# EAGLE schematic Lab9 (EAGLE 8.7.1)
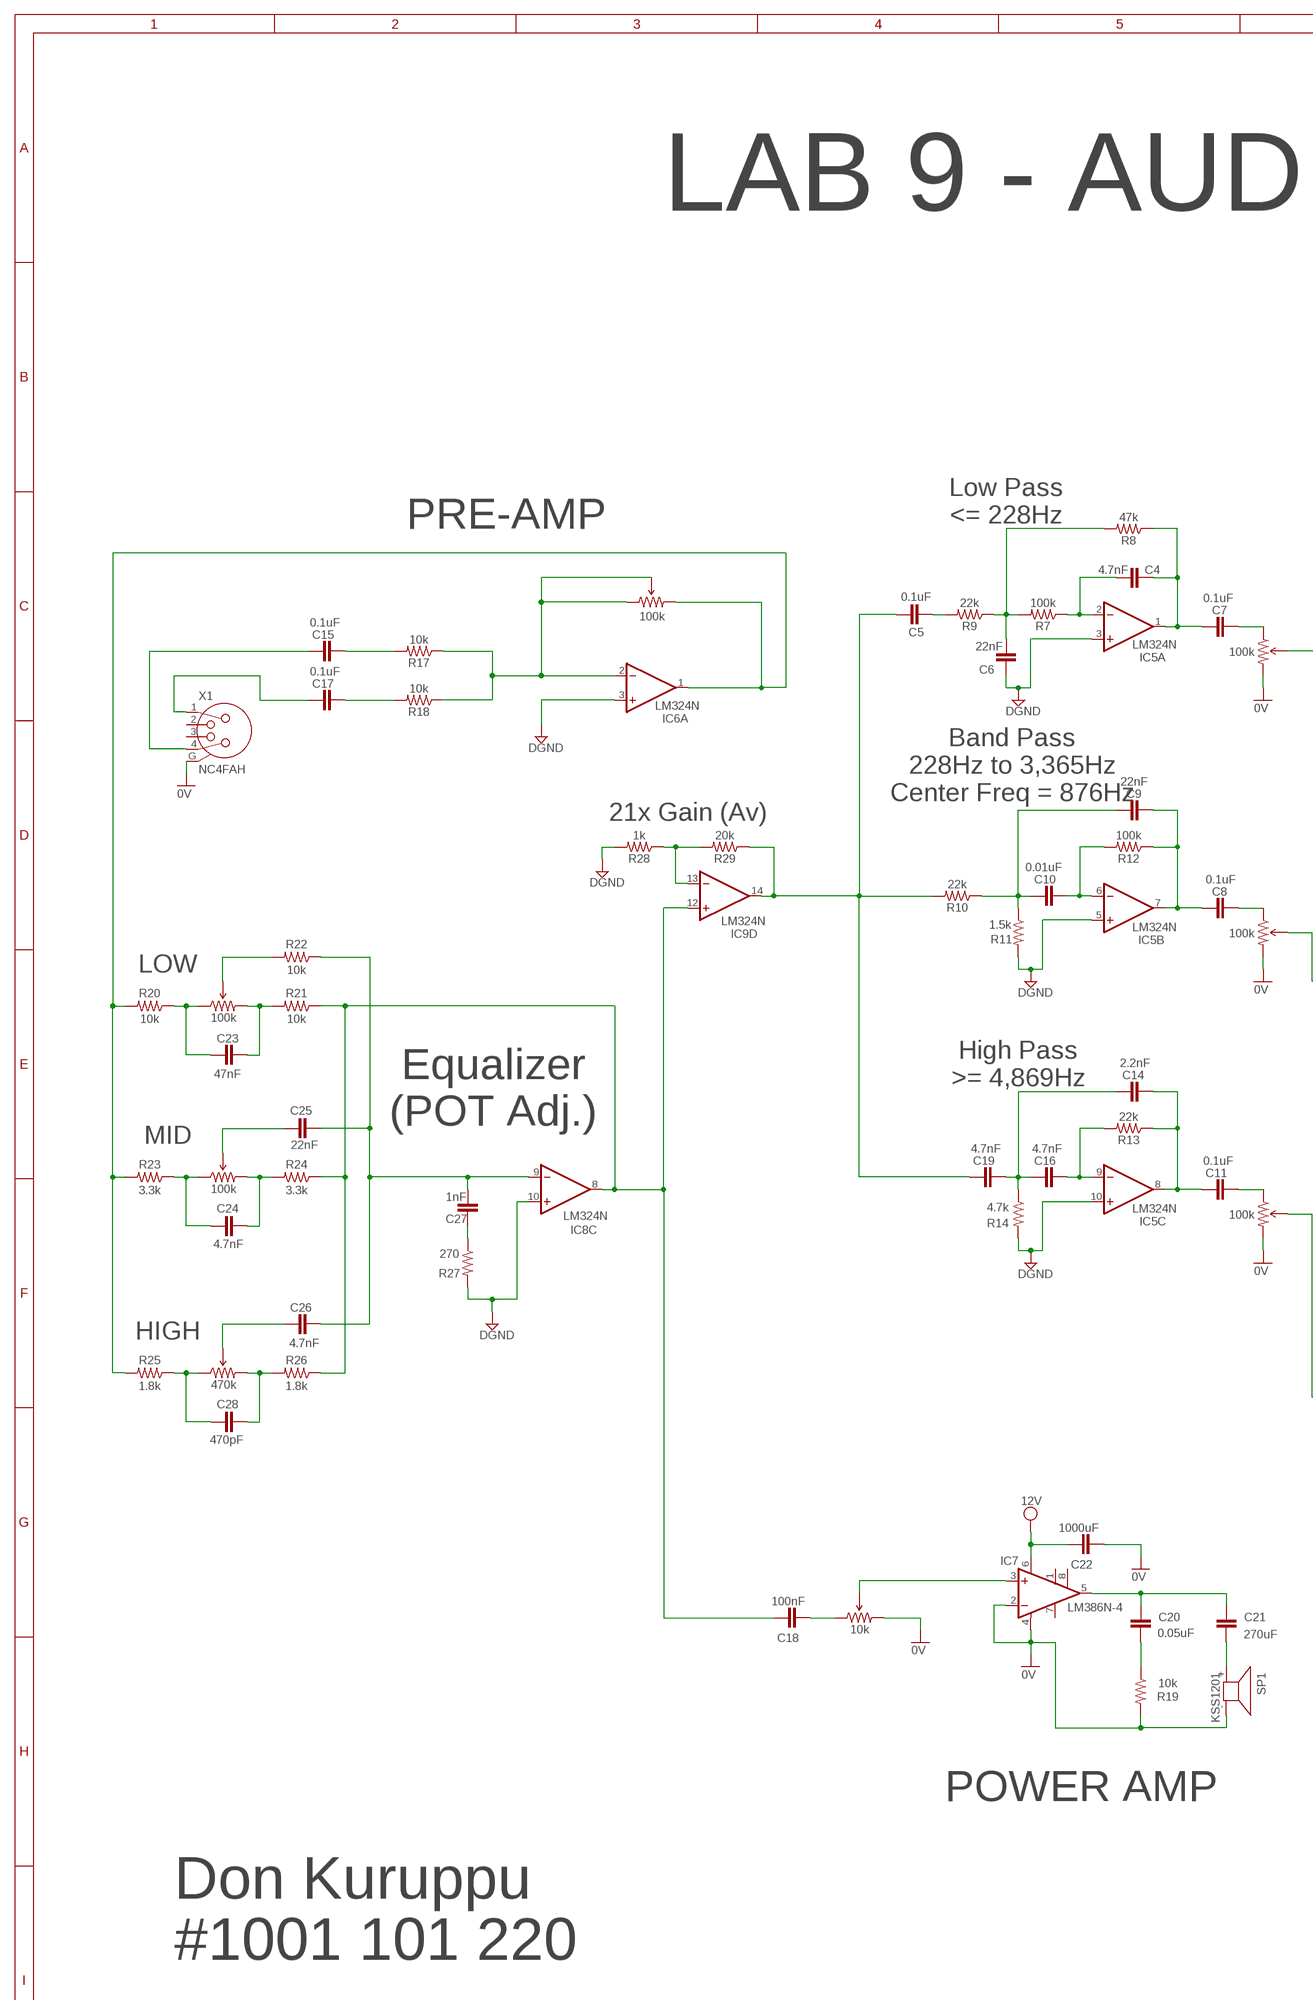
[diagram p0: schematic, sheet 1, part 1 of 2]
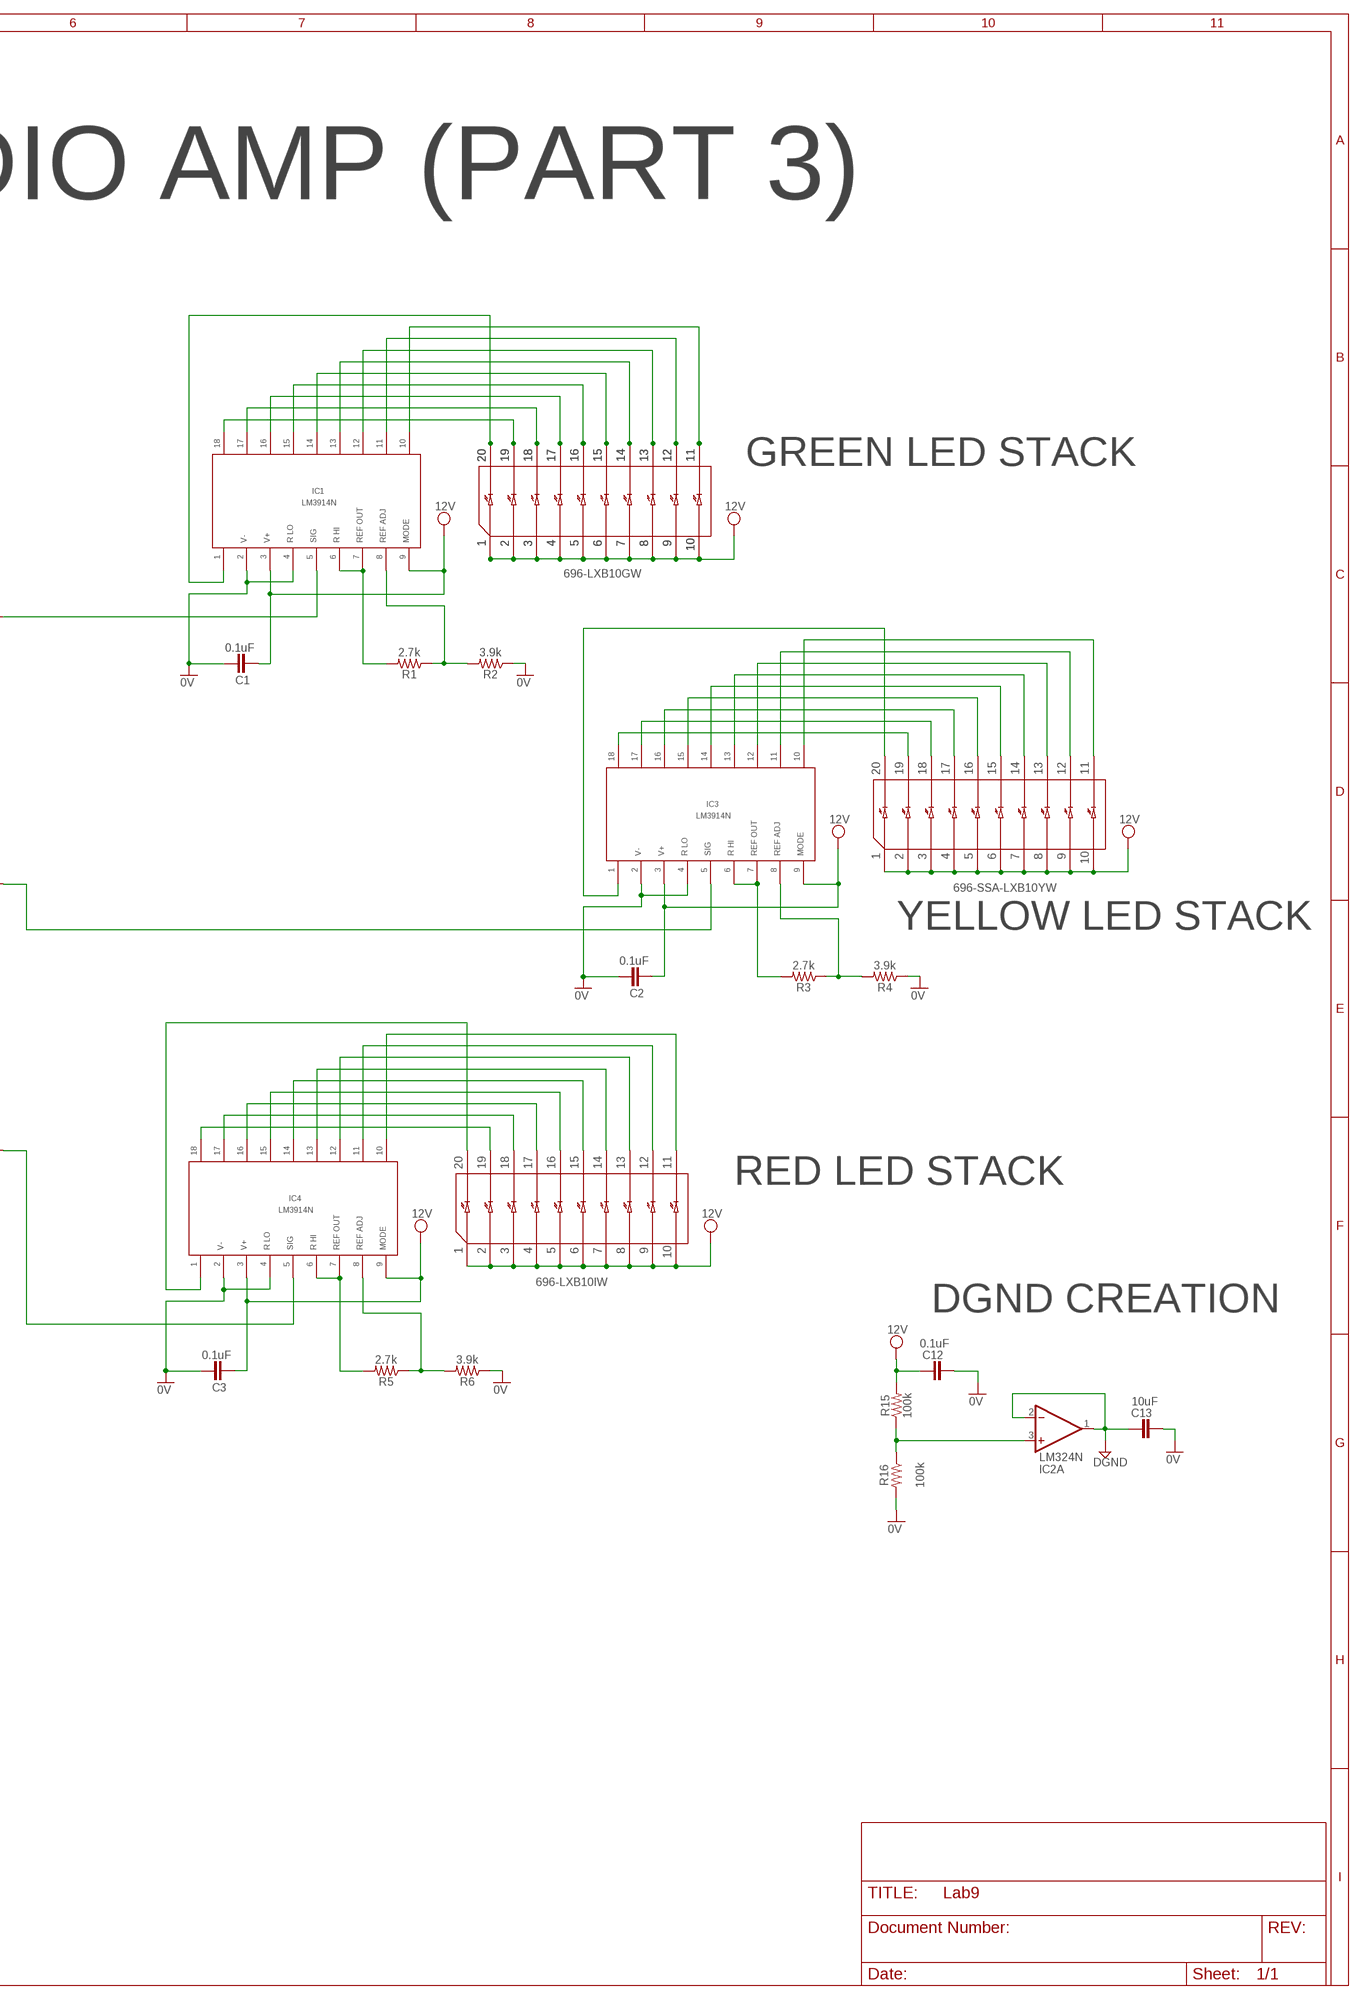
[diagram p1: schematic, sheet 1, part 2 of 2]

## Parts
C1  0.1uF  0.1UF-KIT-EZ-50V-20%  [CAP-PTH-SMALL-KIT]
C2  0.1uF  0.1UF-KIT-EZ-50V-20%  [CAP-PTH-SMALL-KIT]
C3  0.1uF  0.1UF-KIT-EZ-50V-20%  [CAP-PTH-SMALL-KIT]
C4  4.7nF  0.1UF-KIT-EZ-50V-20%  [CAP-PTH-SMALL-KIT]
C5  0.1uF  0.1UF-KIT-EZ-50V-20%  [CAP-PTH-SMALL-KIT]
C6  22nF  0.1UF-KIT-EZ-50V-20%  [CAP-PTH-SMALL-KIT]
C7  0.1uF  0.1UF-KIT-EZ-50V-20%  [CAP-PTH-SMALL-KIT]
C8  0.1uF  0.1UF-KIT-EZ-50V-20%  [CAP-PTH-SMALL-KIT]
C9  22nF  0.1UF-KIT-EZ-50V-20%  [CAP-PTH-SMALL-KIT]
C10  0.01uF  0.1UF-KIT-EZ-50V-20%  [CAP-PTH-SMALL-KIT]
C11  0.1uF  0.1UF-KIT-EZ-50V-20%  [CAP-PTH-SMALL-KIT]
C12  0.1uF  0.1UF-KIT-EZ-50V-20%  [CAP-PTH-SMALL-KIT]
C13  10uF  0.1UF-KIT-EZ-50V-20%  [CAP-PTH-SMALL-KIT]
C14  2.2nF  0.1UF-KIT-EZ-50V-20%  [CAP-PTH-SMALL-KIT]
C15  0.1uF  0.1UF-KIT-EZ-50V-20%  [CAP-PTH-SMALL-KIT]
C16  4.7nF  0.1UF-KIT-EZ-50V-20%  [CAP-PTH-SMALL-KIT]
C17  0.1uF  0.1UF-KIT-EZ-50V-20%  [CAP-PTH-SMALL-KIT]
C18  100nF  0.1UF-KIT-EZ-50V-20%  [CAP-PTH-SMALL-KIT]
C19  4.7nF  0.1UF-KIT-EZ-50V-20%  [CAP-PTH-SMALL-KIT]
C20  0.05uF  0.1UF-KIT-EZ-50V-20%  [CAP-PTH-SMALL-KIT]
C21  270uF  0.1UF-KIT-EZ-50V-20%  [CAP-PTH-SMALL-KIT]
C22  1000uF  0.1UF-KIT-EZ-50V-20%  [CAP-PTH-SMALL-KIT]
C23  47nF  0.1UF-KIT-EZ-50V-20%  [CAP-PTH-SMALL-KIT]
C24  4.7nF  0.1UF-KIT-EZ-50V-20%  [CAP-PTH-SMALL-KIT]
C25  22nF  0.1UF-KIT-EZ-50V-20%  [CAP-PTH-SMALL-KIT]
C26  4.7nF  0.1UF-KIT-EZ-50V-20%  [CAP-PTH-SMALL-KIT]
C27  1nF  0.1UF-KIT-EZ-50V-20%  [CAP-PTH-SMALL-KIT]
C28  470pF  0.1UF-KIT-EZ-50V-20%  [CAP-PTH-SMALL-KIT]
IC1  LM3914N  [DIL18]
IC2  LM324N  [DIL14]
IC3  LM3914N  [DIL18]
IC4  LM3914N  [DIL18]
IC5  LM324N  [DIL14]
IC6  LM324N  [DIL14]
IC7  LM386N-4  [DIL08]
IC8  LM324N  [DIL14]
IC9  LM324N  [DIL14]
POT1  100k  TRIMPOT  [TRIM_POT_PTH]
POT2  100k  TRIMPOT  [TRIM_POT_PTH]
POT3  100k  TRIMPOT  [TRIM_POT_PTH]
POT4  100k  TRIMPOT  [TRIM_POT_PTH]
POT5  10k  TRIMPOT  [TRIM_POT_PTH]
POT6  100k  TRIMPOT  [TRIM_POT_PTH]
POT7  100k  TRIMPOT  [TRIM_POT_PTH]
POT8  470k  TRIMPOT  [TRIM_POT_PTH]
R1  2.7k  100KOHM-HORIZ-1/4W-1%  [AXIAL-0.3]
R2  3.9k  100KOHM-HORIZ-1/4W-1%  [AXIAL-0.3]
R3  2.7k  100KOHM-HORIZ-1/4W-1%  [AXIAL-0.3]
R4  3.9k  100KOHM-HORIZ-1/4W-1%  [AXIAL-0.3]
R5  2.7k  100KOHM-HORIZ-1/4W-1%  [AXIAL-0.3]
R6  3.9k  100KOHM-HORIZ-1/4W-1%  [AXIAL-0.3]
R7  100k  100KOHM-HORIZ-1/4W-1%  [AXIAL-0.3]
R8  47k  100KOHM-HORIZ-1/4W-1%  [AXIAL-0.3]
R9  22k  100KOHM-HORIZ-1/4W-1%  [AXIAL-0.3]
R10  22k  100KOHM-HORIZ-1/4W-1%  [AXIAL-0.3]
R11  1.5k  100KOHM-HORIZ-1/4W-1%  [AXIAL-0.3]
R12  100k  100KOHM-HORIZ-1/4W-1%  [AXIAL-0.3]
R13  22k  100KOHM-HORIZ-1/4W-1%  [AXIAL-0.3]
R14  4.7k  100KOHM-HORIZ-1/4W-1%  [AXIAL-0.3]
R15  100k  100KOHM-HORIZ-1/4W-1%  [AXIAL-0.3]
R16  100k  100KOHM-HORIZ-1/4W-1%  [AXIAL-0.3]
R17  10k  100KOHM-HORIZ-1/4W-1%  [AXIAL-0.3]
R18  10k  100KOHM-HORIZ-1/4W-1%  [AXIAL-0.3]
R19  10k  100KOHM-HORIZ-1/4W-1%  [AXIAL-0.3]
R20  10k  100KOHM-HORIZ-1/4W-1%  [AXIAL-0.3]
R21  10k  100KOHM-HORIZ-1/4W-1%  [AXIAL-0.3]
R22  10k  100KOHM-HORIZ-1/4W-1%  [AXIAL-0.3]
R23  3.3k  100KOHM-HORIZ-1/4W-1%  [AXIAL-0.3]
R24  3.3k  100KOHM-HORIZ-1/4W-1%  [AXIAL-0.3]
R25  1.8k  100KOHM-HORIZ-1/4W-1%  [AXIAL-0.3]
R26  1.8k  100KOHM-HORIZ-1/4W-1%  [AXIAL-0.3]
R27  270  100KOHM-HORIZ-1/4W-1%  [AXIAL-0.3]
R28  1k  100KOHM-HORIZ-1/4W-1%  [AXIAL-0.3]
R29  20k  100KOHM-HORIZ-1/4W-1%  [AXIAL-0.3]
SP1  KSS1201  [KSS1201]
STACK1  696-LXB10GW  [LED_STACK_PROTO]
STACK2  696-LXB10GW  [LED_STACK_PROTO]
STACK3  696-SSA-LXB10YW  [LED_STACK_PROTO]
STACK4  696-LXB10IW  [LED_STACK_PROTO]
X1  NC4FAH  [NC4FAH]

## Nets
0V: C1.1 C2.1 C3.1 C12.2 C13.2 C22.2 IC1.2 IC1.4 IC3.2 IC3.4 IC4.2 IC4.4 IC7.2(-IN) IC7.4(GND) POT1.3(CW) POT2.3(CW) POT3.3(CW) POT5.3(CW) R2.P$1 R4.P$1 R6.P$1 R16.P$2 R19.P$2 SP1.- X1.G
DGND: C6.1 C13.1 IC2.1(A:OUT) IC2.2(A:-IN) IC5.3(A:+IN) IC5.5(B:+IN) IC5.10(C:+IN) IC6.3(A:+IN) IC8.10(C:+IN) R11.P$2 R14.P$2 R27.P$2 R28.P$2
N$1: IC1.6 IC1.7 R1.P$2
N$2: IC2.3(A:+IN) R15.P$1 R16.P$1
N$3: IC1.1 STACK1.P$11 STACK2.P$11
N$4: IC1.18 STACK1.P$12 STACK2.P$12
N$5: IC1.17 STACK1.P$13 STACK2.P$13
N$6: IC1.16 STACK1.P$14 STACK2.P$14
N$7: IC1.15 STACK1.P$15 STACK2.P$15
N$8: C17.1 X1.1
N$9: C15.1 X1.4
N$10: IC1.14 STACK1.P$16 STACK2.P$16
N$11: C15.2 R17.P$2
N$12: IC1.13 STACK1.P$17 STACK2.P$17
N$13: IC1.12 STACK1.P$18 STACK2.P$18
N$14: IC1.11 STACK1.P$19 STACK2.P$19
N$15: C5.2 R9.P$2
N$16: IC1.5 POT1.2(WIPER)
N$17: C17.2 R18.P$2
N$18: IC1.10 STACK1.P$20 STACK2.P$20
N$19: IC1.8 R1.P$1 R2.P$2
N$20: IC4.1 STACK4.P$11
N$21: IC3.1 STACK3.P$11
N$22: IC3.18 STACK3.P$12
N$23: IC3.17 STACK3.P$13
N$24: IC3.16 STACK3.P$14
N$25: IC3.15 STACK3.P$15
N$26: IC3.14 STACK3.P$16
N$27: IC3.13 STACK3.P$17
N$28: IC3.12 STACK3.P$18
N$29: IC3.11 STACK3.P$19
N$30: IC3.10 STACK3.P$20
N$31: IC3.6 IC3.7 R3.P$2
N$32: IC3.8 R3.P$1 R4.P$2
N$33: IC3.5 POT2.2(WIPER)
N$34: IC4.18 STACK4.P$12
N$35: IC4.17 STACK4.P$13
N$36: IC4.16 STACK4.P$14
N$37: IC4.15 STACK4.P$15
N$38: IC4.14 STACK4.P$16
N$39: IC4.13 STACK4.P$17
N$40: IC4.12 STACK4.P$18
N$41: IC4.11 STACK4.P$19
N$42: IC4.10 STACK4.P$20
N$43: IC4.6 IC4.7 R5.P$2
N$44: IC4.8 R5.P$1 R6.P$2
N$45: IC4.5 POT3.2(WIPER)
N$46: C4.1 IC5.2(A:-IN) R7.P$1
N$47: C4.2 C7.1 IC5.1(A:OUT) R8.P$1
N$48: C7.2 POT1.1(CCW)
N$49: C9.1 C10.1 R10.P$1 R11.P$1
N$50: C10.2 IC5.6(B:-IN) R12.P$2
N$51: C8.1 C9.2 IC5.7(B:OUT) R12.P$1
N$52: C5.1 C19.1 IC9.14(D:OUT) R10.P$2 R29.P$1
N$53: C8.2 POT2.1(CCW)
N$54: C11.2 POT3.1(CCW)
N$55: C14.1 C16.1 C19.2 R14.P$1
N$56: C16.2 IC5.9(C:-IN) R13.P$2
N$57: C18.2 POT5.1(CCW)
N$58: C11.1 C14.2 IC5.8(C:OUT) R13.P$1
N$59: C6.2 R7.P$2 R8.P$2 R9.P$1
N$60: C20.1 C21.1 IC7.5(OUT)
N$61: IC6.2(A:-IN) POT4.1(CCW) POT4.2(WIPER) R17.P$1 R18.P$1
N$62: IC7.3(+IN) POT5.2(WIPER)
N$63: C20.2 R19.P$1
N$64: C21.2 SP1.+
N$65: C27.1 R27.P$1
N$68: C23.1 POT6.1(CCW) R20.P$1
N$69: C23.2 POT6.3(CW) R21.P$2
N$70: IC6.1(A:OUT) POT4.3(CW) R20.P$2 R23.P$2 R25.P$2
N$71: IC9.13(D:-IN) R28.P$1 R29.P$2
N$72: POT6.2(WIPER) R22.P$2
N$73: C24.1 POT7.1(CCW) R23.P$1
N$74: C24.2 POT7.3(CW) R24.P$2
N$75: C18.1 IC8.8(C:OUT) IC9.12(D:+IN) R21.P$1 R24.P$1 R26.P$1
N$77: C25.1 POT7.2(WIPER)
N$78: C28.1 POT8.1(CCW) R25.P$1
N$79: C28.2 POT8.3(CW) R26.P$2
N$80: C26.1 POT8.2(WIPER)
N$82: C25.2 C26.2 C27.2 IC8.9(C:-IN) R22.P$1
VCC: C1.2 C2.2 C3.2 C12.1 C22.1 IC1.3 IC1.9 IC3.3 IC3.9 IC4.3 IC4.9 IC7.6(VS) R15.P$2 STACK1.P$1 STACK1.P$2 STACK1.P$3 STACK1.P$4 STACK1.P$5 STACK1.P$6 STACK1.P$7 STACK1.P$8 STACK1.P$9 STACK1.P$10 STACK2.P$1 STACK2.P$2 STACK2.P$3 STACK2.P$4 STACK2.P$5 STACK2.P$6 STACK2.P$7 STACK2.P$8 STACK2.P$9 STACK2.P$10 STACK3.P$1 STACK3.P$2 STACK3.P$3 STACK3.P$4 STACK3.P$5 STACK3.P$6 STACK3.P$7 STACK3.P$8 STACK3.P$9 STACK3.P$10 STACK4.P$1 STACK4.P$2 STACK4.P$3 STACK4.P$4 STACK4.P$5 STACK4.P$6 STACK4.P$7 STACK4.P$8 STACK4.P$9 STACK4.P$10
Unconnected: IC2.5(B:+IN) IC2.6(B:-IN) IC2.7(B:OUT) IC2.8(C:OUT) IC2.9(C:-IN) IC2.10(C:+IN) IC2.12(D:+IN) IC2.13(D:-IN) IC2.14(D:OUT) IC5.12(D:+IN) IC5.13(D:-IN) IC5.14(D:OUT) IC6.5(B:+IN) IC6.6(B:-IN) IC6.7(B:OUT) IC6.8(C:OUT) IC6.9(C:-IN) IC6.10(C:+IN) IC6.12(D:+IN) IC6.13(D:-IN) IC6.14(D:OUT) IC7.1(GAIN) IC7.7(BYPASS) IC7.8(GAIN) IC8.1(A:OUT) IC8.2(A:-IN) IC8.3(A:+IN) IC8.5(B:+IN) IC8.6(B:-IN) IC8.7(B:OUT) IC8.12(D:+IN) IC8.13(D:-IN) IC8.14(D:OUT) IC9.1(A:OUT) IC9.2(A:-IN) IC9.3(A:+IN) IC9.5(B:+IN) IC9.6(B:-IN) IC9.7(B:OUT) IC9.8(C:OUT) IC9.9(C:-IN) IC9.10(C:+IN) X1.2 X1.3

## Notes on the sheet
- LAB 9 - AUDIO AMP (PART 3)
- GREEN LED STACK
- Low Pass
  <= 228Hz
- PRE-AMP
- Band Pass
  228Hz to 3,365Hz
  Center Freq = 876Hz
- 21x Gain (Av)
- LOW
- YELLOW LED STACK
- High Pass
  >= 4,869Hz
- Equalizer
  (POT Adj.)
- MID
- RED LED STACK
- HIGH
- DGND CREATION
- POWER AMP
- Don Kuruppu
- #1001 101 220

## Power pins joined to a net without a drawn wire
V+: IC2.4(P:V+) IC5.4(P:V+) IC6.4(P:V+) IC8.4(P:V+) IC9.4(P:V+)
V-: IC2.11(P:V-) IC5.11(P:V-) IC6.11(P:V-) IC8.11(P:V-) IC9.11(P:V-)

## Library data of the parts
C1-C3 C5 C7 C8 C11 C12 C15 C17 = SparkFun-Capacitors:0.1UF: 0.1µF ceramic capacitors A capacitor is a passive two-terminal electrical component used to store electrical energy temporarily in an electric field.; PROD_ID: CAP-08370
C4 C6 C9 C10 C13 C14 C16 C18-C28 = SparkFun-Capacitors:0.1UF: 0.1µF ceramic capacitors A capacitor is a passive two-terminal electrical component used to store electrical energy temporarily in an electric field.; PROD_ID: CAP-08370; VALUE: 0.1uF
IC1 IC3 IC4 = lab7:LM3914N
IC2 IC5 IC6 IC8 IC9 = linear:LM324: OP AMP
IC7 = linear:LM386?-*: Low Voltage Audio Power Amplifier Source: http://cache.national.com/ds/LM/LM386.pdf
POT1-POT8 = Brent:TRIMPOT
R1-R6 R8-R11 R13 R14 R17-R29 = SparkFun-Resistors:100KOHM: 100kΩ resistor A resistor is a passive two-terminal electrical component that implements electrical resistance as a circuit element. Resistors act to reduce current flow, and, at the same time, act to lower voltage levels within circuits. - Wikipedia; PROD_ID: RES-12184; VALUE: 100k
R7 R12 R15 R16 = SparkFun-Resistors:100KOHM: 100kΩ resistor A resistor is a passive two-terminal electrical component that implements electrical resistance as a circuit element. Resistors act to reduce current flow, and, at the same time, act to lower voltage levels within circuits. - Wikipedia; PROD_ID: RES-12184
SP1 = buzzer:KSS1201: SPEAKER Source: Schukat; OC_FARNELL: unknown; OC_NEWARK: unknown
STACK1 STACK2 = lab7:696-LXB10GW
STACK3 = lab7:696-SSA-LXB10YW
STACK4 = lab7:696-LXB10IW
X1 = con-neutrik_ag:NC4: Neutrik Audio Connector XLR SERIES Stereo 1/4" jack Source: www.neutrik.com/; MPN: NC4FAH; OC_FARNELL: unknown; OC_NEWARK: 88C9787